# EAGLE schematic MIDIThereminCPU (EAGLE 7.7.0)
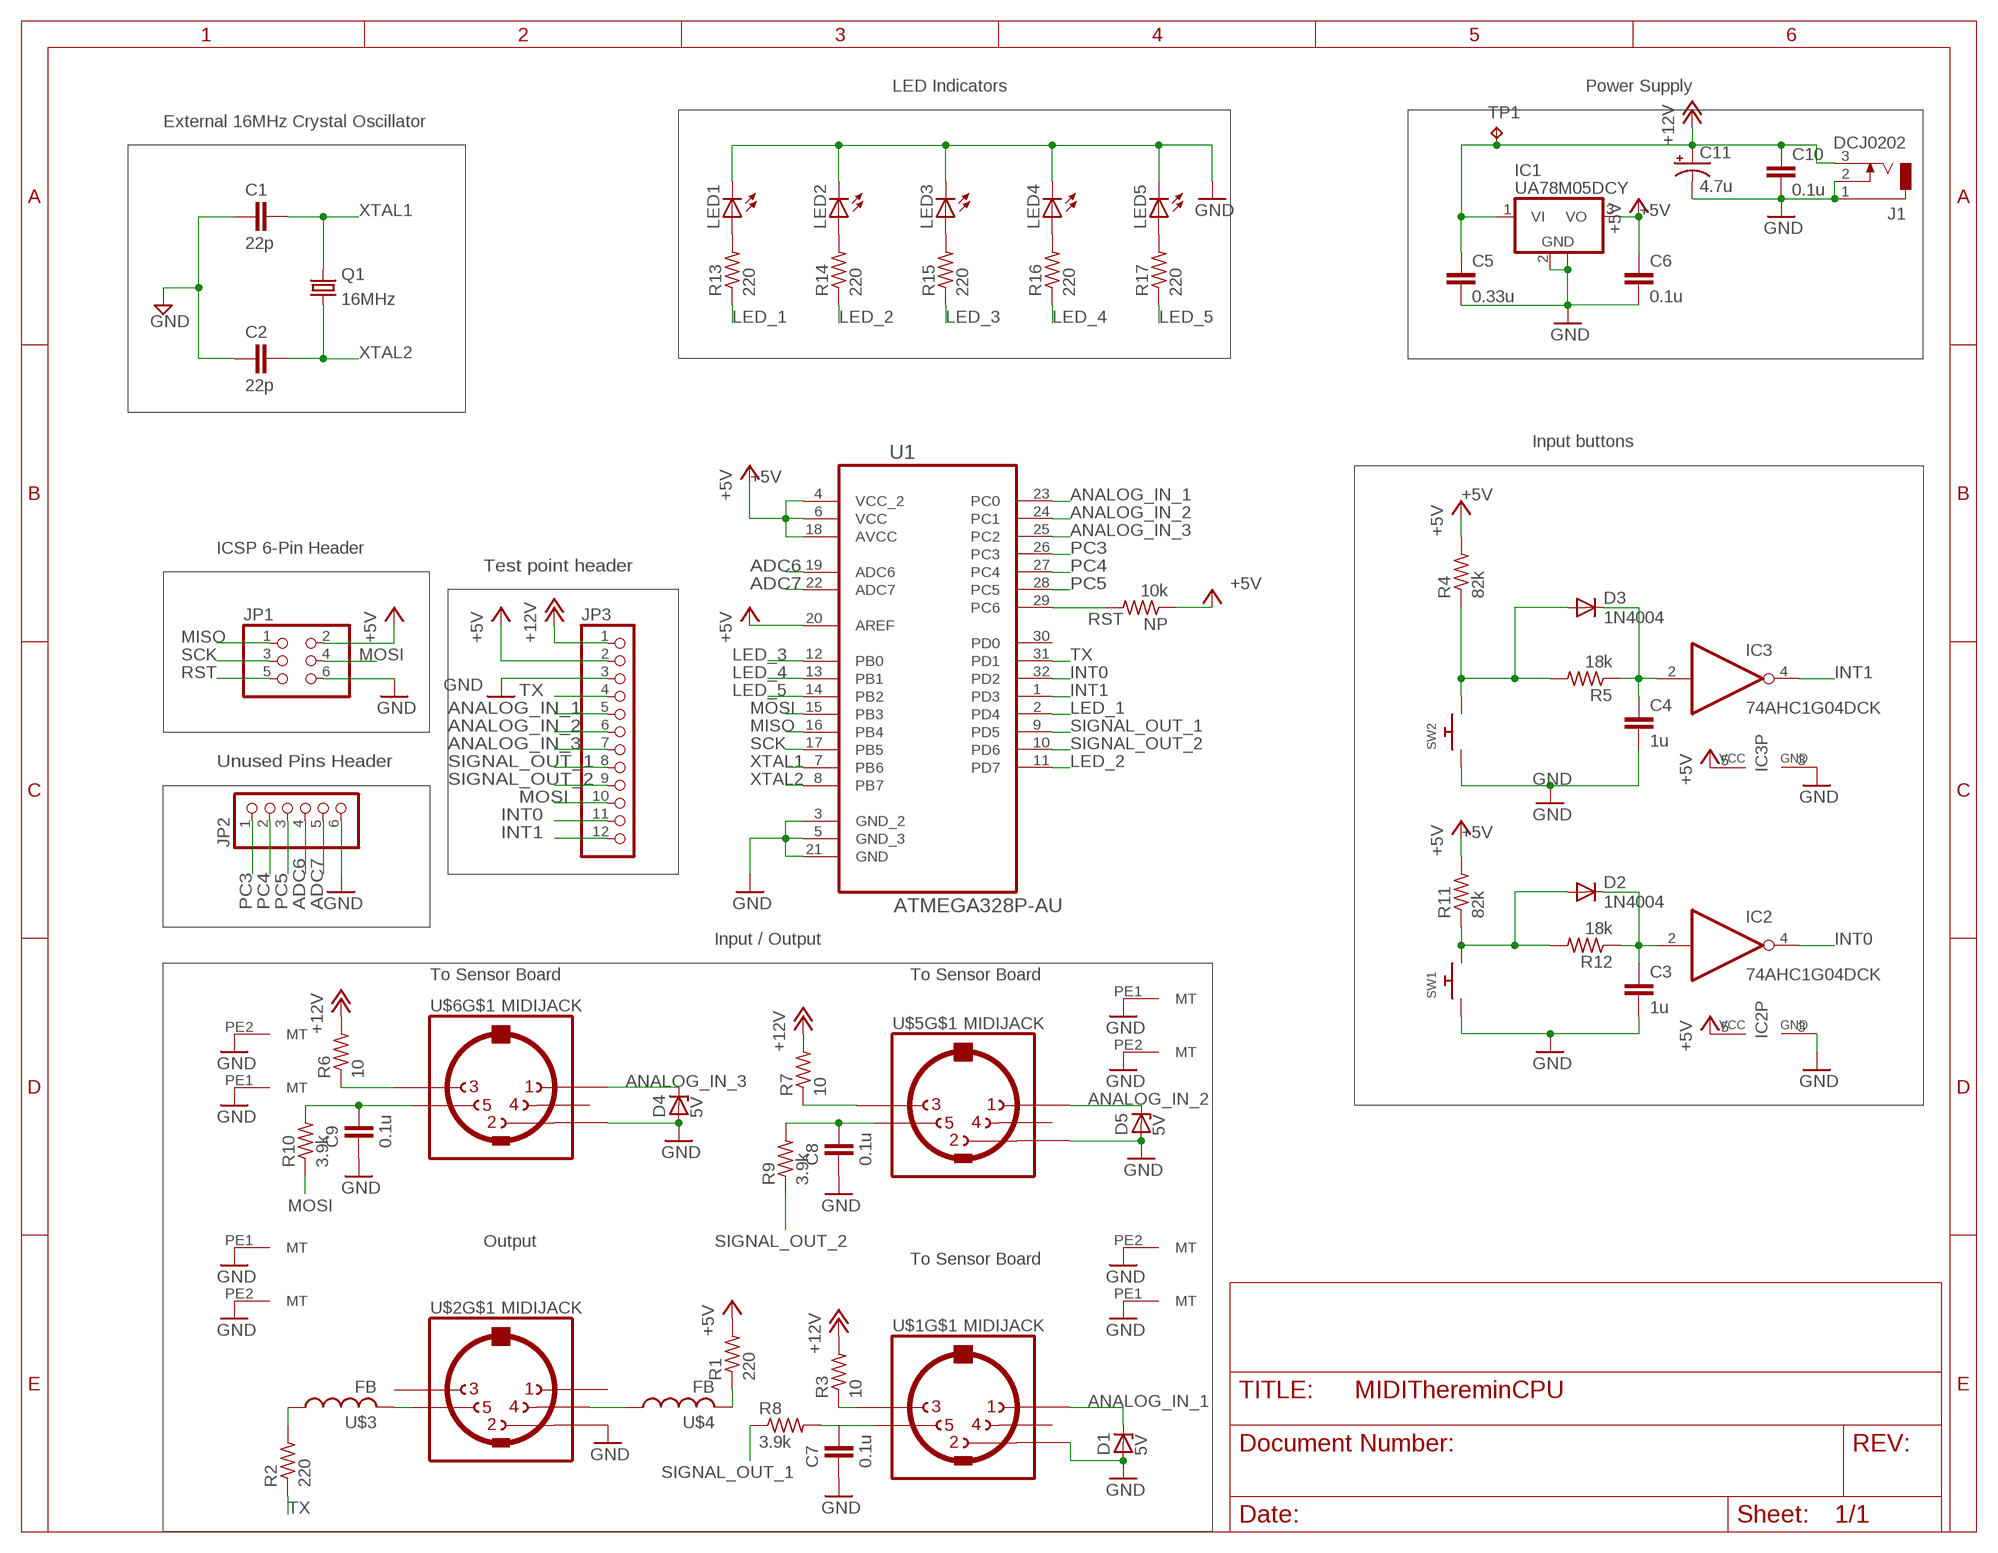
[diagram p0: schematic, sheet 1]

## Parts
C1  22p  C2,5-3  [C2.5-3]
C2  22p  C2,5-3  [C2.5-3]
C3  1u  C2,5-3  [C2.5-3]
C4  1u  C2,5-3  [C2.5-3]
C5  0.33u  C2,5-3  [C2.5-3]
C6  0.1u  C2,5-3  [C2.5-3]
C7  0.1u  C2,5-3  [C2.5-3]
C8  0.1u  C2,5-3  [C2.5-3]
C9  0.1u  C2,5-3  [C2.5-3]
C10  0.1u  C2,5-3  [C2.5-3]
C11  4.7u  CPOL-USE3.5-8  [E3,5-8]
D1  5V  ZENER-DIODEP1-Z12  [P1Z12]
D2  1N4004  [DO41-10]
D3  1N4004  [DO41-10]
D4  5V  ZENER-DIODEP1-Z12  [P1Z12]
D5  5V  ZENER-DIODEP1-Z12  [P1Z12]
IC1  UA78M05DCY  [SOT223]
IC2  74AHC1G04DCK  [SC70-5]
IC3  74AHC1G04DCK  [SC70-5]
J1  DCJ0202  [DCJ0202]
JP1  PINHD-2X3  [2X03]
JP2  PINHD-1X6  [1X06]
JP3  PINHD-1X12  [1X12]
LED1  LEDB155  [Q62902-B155]
LED2  LEDB155  [Q62902-B155]
LED3  LEDB155  [Q62902-B155]
LED4  LEDB155  [Q62902-B155]
LED5  LEDB155  [Q62902-B155]
NP  10k  R-US_0207/10  [0207/10]
Q1  16MHz  CRYSTALSM49  [SM49]
R1  220  R-US_0207/10  [0207/10]
R2  220  R-US_0207/10  [0207/10]
R3  10  R-US_0207/10  [0207/10]
R4  82k  R-US_0207/10  [0207/10]
R5  18k  R-US_0207/10  [0207/10]
R6  10  R-US_0207/10  [0207/10]
R7  10  R-US_0207/10  [0207/10]
R8  3.9k  R-US_0207/10  [0207/10]
R9  3.9k  R-US_0207/10  [0207/10]
R10  3.9k  R-US_0207/10  [0207/10]
R11  82k  R-US_0207/10  [0207/10]
R12  18k  R-US_0207/10  [0207/10]
R13  220  R-US_0207/10  [0207/10]
R14  220  R-US_0207/10  [0207/10]
R15  220  R-US_0207/10  [0207/10]
R16  220  R-US_0207/10  [0207/10]
R17  220  R-US_0207/10  [0207/10]
SW1  SWITCH_PUSHBUTTONSOFTTOUCHSMD_SJ  [PUSHBUTTON_SMD_SJ]
SW2  SWITCH_PUSHBUTTONSOFTTOUCHSMD_SJ  [PUSHBUTTON_SMD_SJ]
TP1  TPTP15SQ  [TP15SQ]
U1  ATMEGA328P-AU  [QFP80P900X900X120-32N]
U$1  MIDIJACK  [CP-2350]
U$2  MIDIJACK  [CP-2350]
U$3  FB  [FB]
U$4  FB  [FB]
U$5  MIDIJACK  [CP-2350]
U$6  MIDIJACK  [CP-2350]

## Nets
+5V: C6.1 IC1.3(VO) IC2.5(VCC) IC3.5(VCC) JP1.2 JP3.2 NP.1 R1.2 R4.2 R11.2 U1.4(VCC_2) U1.6(VCC) U1.18(AVCC) U1.20(AREF)
+12V: C5.1 C10.1 C11.+ IC1.1(VI) J1.3 JP3.1 R3.2 R6.2 R7.2 TP1.TP
ADC6: JP2.4 U1.19(ADC6)
ADC7: JP2.5 U1.22(ADC7)
ANALOG_IN_1: D1.C JP3.5 U1.23(PC0) U$1.1
ANALOG_IN_2: D5.C JP3.6 U1.24(PC1) U$5.1
ANALOG_IN_3: D4.C JP3.7 U1.25(PC2) U$6.1
GND: C1.1 C2.1 C3.2 C4.2 C5.2 C6.2 C7.1 C8.1 C9.1 C10.2 C11.- D1.A D4.A D5.A IC1.2(GND) IC1.4(GND) IC2.3(GND) IC3.3(GND) J1.1 J1.2 JP1.6 JP2.6 JP3.3 LED1.K(C) LED2.K(C) LED3.K(C) LED4.K(C) LED5.K(C) SW1.P$1 SW2.P$1 U1.3(GND_2) U1.5(GND_3) U1.21(GND) U$1.2 U$1.PE1(MT) U$1.PE2(MT) U$2.2 U$2.PE1(MT) U$2.PE2(MT) U$5.2 U$5.PE1(MT) U$5.PE2(MT) U$6.2 U$6.PE1(MT) U$6.PE2(MT)
INT0: IC2.4(O) JP3.11 U1.32(PD2)
INT1: IC3.4(O) JP3.12 U1.1(PD3)
LED_1: R13.1 U1.2(PD4)
LED_2: R14.1 U1.11(PD7)
LED_3: R15.1 U1.12(PB0)
LED_4: R16.1 U1.13(PB1)
LED_5: R17.1 U1.14(PB2)
MISO: JP1.1 U1.16(PB4)
MOSI: JP1.4 JP3.10 R10.1 U1.15(PB3)
N$1: U$2.4 U$4.P$1
N$2: R1.1 U$4.P$2
N$3: U$2.5 U$3.P$2
N$4: D3.A R4.1 R5.2 SW2.P$2
N$5: C9.2 R10.2 U$6.5
N$6: C4.1 D3.C IC3.2(I) R5.1
N$7: LED1.A R13.2
N$8: R6.1 U$6.3
N$9: LED2.A R14.2
N$10: C8.2 R9.2 U$5.5
N$11: D2.A R11.1 R12.2 SW1.P$2
N$12: R3.1 U$1.3
N$13: R2.2 U$3.P$1
N$14: C3.1 D2.C IC2.2(I) R12.1
N$15: LED3.A R15.2
N$16: LED4.A R16.2
N$17: LED5.A R17.2
N$20: R7.1 U$5.3
N$26: C7.2 R8.2 U$1.5
PC3: JP2.1 U1.26(PC3)
PC4: JP2.2 U1.27(PC4)
PC5: JP2.3 U1.28(PC5)
RST: JP1.5 NP.2 U1.29(PC6)
SCK: JP1.3 U1.17(PB5)
SIGNAL_OUT_1: JP3.8 R8.1 U1.9(PD5)
SIGNAL_OUT_2: JP3.9 R9.1 U1.10(PD6)
TX: JP3.4 R2.1 U1.31(PD1)
XTAL1: C1.2 Q1.2 U1.7(PB6)
XTAL2: C2.2 Q1.1 U1.8(PB7)
Unconnected: U1.30(PD0) U$1.4 U$1.PE(MT) U$1.PE@(MT) U$2.1 U$2.3 U$2.PE(MT) U$2.PE@(MT) U$5.4 U$5.PE(MT) U$5.PE@(MT) U$6.4 U$6.PE(MT) U$6.PE@(MT)

## Notes on the sheet
- LED Indicators | Power Supply
- External 16MHz Crystal Oscillator
- Input buttons
- ICSP 6-Pin Header
- Test point header
- Unused Pins Header
- Input / Output
- To Sensor Board | To Sensor Board
- Output
- To Sensor Board

## Library data of the parts
C1-C10 = capacitor-wima:C: CAPACITOR naming: grid - package width
C11 = adafruit:CPOL-US: POLARIZED CAPACITOR, American symbol
D1 D4 D5 = diode:ZENER-DIODE: Z-Diode
D2 D3 = diode:1N4004: DIODE general purpose rectifier, 1 A
IC1 = linear:UA78M*: POSITIVE-VOLTAGE REGULATORS Source: http://focus.ti.com/lit/ds/symlink/ua78m33.pdf
IC2 IC3 = 74xx-little-us:74*1G04: INVERTER Gate
J1 = con-jack:DCJ0202: DC POWER JACK Source: DCJ0202.pdf; OC_FARNELL: unknown; OC_NEWARK: unknown
JP1 = pinhead:PINHD-2X3: PIN HEADER
JP2 = adafruit:PINHD-1X6: PIN HEADER
JP3 = adafruit:PINHD-1X12: PIN HEADER
LED1-LED5 = adafruit:LED: LED OSRAM: - CHIPLED LG R971, LG N971, LY N971, LG Q971, LY Q971, LO R971, LY R971 LH N974, LH R974 LS Q976, LO Q976, LY Q976 LO Q996 - Hyper CHIPLED LW Q18S LB Q993, LB Q99A, LB R99A - SideLED LS A670, LO A670, LY A670, LG A670, LP A670 LB A673, LV A673, LT A673, LW A673 LH A674 LY A675 LS A676, LA A676, LO A676, LY A676, LW A676 LS A679, LY A679, LG A679 - Hyper Micro SIDELED® LS Y876, LA Y876, LO Y876, LY Y876 LT Y87S - SmartLED LW L88C, LW L88S LB L89C, LB L89S, LG L890 LS L89K, LO L89K, LY L89K LS L896, LA L896, LO L896, LY L896 - TOPLED LS T670, LO T670, LY T670, LG T670, LP T670 LSG T670, LSP T670, LSY T670, LOP T670, LYG T670 LG T671, LOG T671, LSG T671 LB T673, LV T673, LT T673, LW T673 LH T674 LS T676, LA T676, LO T676, LY T676, LB T676, LH T676, LSB T676, LW T676 LB T67C, LV T67C, LT T67C, LS T67K, LO T67K, LY T67K, LW E67C LS E67B, LA E67B, LO E67B, LY E67B, LB E67C, LV E67C, LT E67C LW T67C LS T679, LY T679, LG T679 LS T770, LO T770, LY T770, LG T770, LP T770 LB T773, LV T773, LT T773, LW T773 LH T774 LS E675, LA E675, LY E675, LS T675 LS T776, LA T776, LO T776, LY T776, LB T776 LHGB T686 LT T68C, LB T68C - Hyper Mini TOPLED® LB M676 - Mini TOPLED Santana® LG M470 LS M47K, LO M47K, LY M47K Source: http://www.osram.convergy.de/
NP R1-R17 = resistor:R-US_: RESISTOR, American symbol
Q1 = crystal:CRYSTAL: CRYSTAL; OC_FARNELL: unknown; OC_NEWARK: unknown
SW1 SW2 = adafruit:SWITCH_PUSHBUTTON: Buttons SOFTTOUCHSMD_SJ - Soft touch temporary push button (Super Junk Akihabara) Compatible with SKPMANE010 [Mouser: 688-SKPMAN] C&K_KSS = Digikey: KSS221GLFS
TP1 = testpad:TP: Test pad
U1 = Atmel_By_element14_Batch_1-00:ATMEGA328P-AU: 8-bit Microcontroller with In-System Programmable Flash; MPN: ATMEGA328P-AU; OC_FARNELL: 1715486; OC_NEWARK: 14R4631; PACKAGE: TQFP-32; SUPPLIER: Atmel
U$1 U$2 U$5 U$6 = adafruit:MIDIJACK: DIN 5 jack also known as MIDI jack A modification of conn-hirshman:MAB5SH with two options for the grounding 'teeth'
U$3 U$4 = adafruit:FB: Ferrite bead Digikey #P9821BK-ND